# EAGLE design Adafruit MCP2221 (EAGLE 9.5.2)
COMPANY: ADAFRUIT INDUSTRIES; DRAWN: LADYADA; REV: A
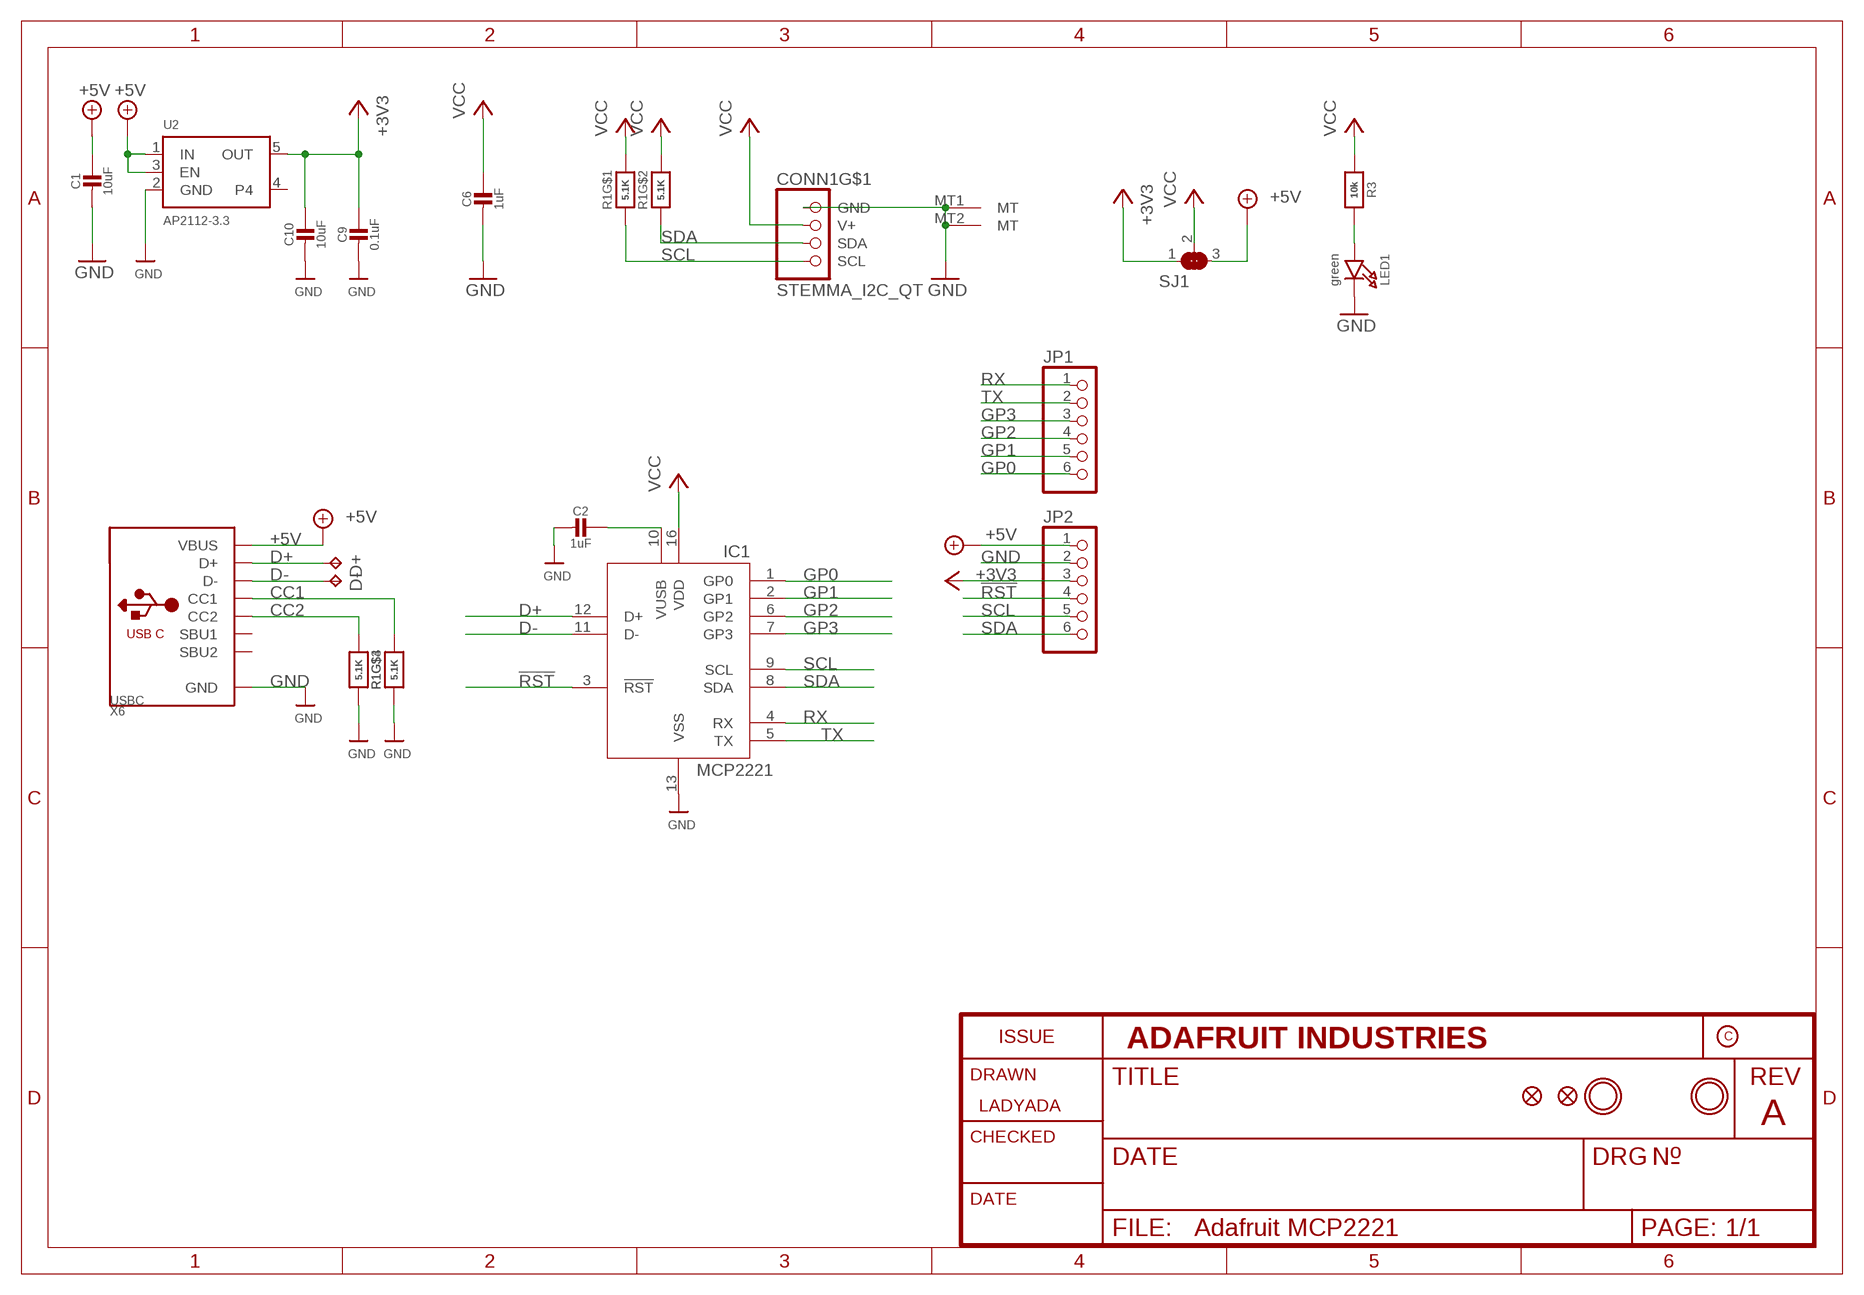
[diagram p0: schematic, sheet 1]

## Parts
C1  10uF  CAP_CERAMIC0805-NOOUTLINE  [0805-NO]
C2  1uF  CAP_CERAMIC0603_NO  [0603-NO]
C6  1uF  CAP_CERAMIC0603_NO  [0603-NO]
C9  0.1uF  CAP_CERAMIC0603_NO  [0603-NO]
C10  10uF  CAP_CERAMIC0805-NOOUTLINE  [0805-NO]
CONN1  STEMMA_I2C_QT  [JST_SH4]
D+  TPTP17R  [TP17R]
D-  TPTP17R  [TP17R]
FID1  FIDUCIAL_1MM  [FIDUCIAL_1MM]
FID2  FIDUCIAL_1MM  [FIDUCIAL_1MM]
IC1  MCP2221_ML  [QFN16_4MM]
JP1  HEADER-1X670MIL  [1X06_ROUND_70]
JP2  HEADER-1X670MIL  [1X06_ROUND_70]
LED1  green  LED0603_NOOUTLINE  [CHIPLED_0603_NOOUTLINE]
R1  5.1K  RESISTOR_4PACK  [RESPACK_4X0603]
R3  10k  RESISTOR_0603_NOOUT  [0603-NO]
SJ1  SOLDERJUMPER_2WAY  [SOLDERJUMPER_2WAY_OPEN_NOPASTE]
U2  AP2112-3.3  VREG_SOT23-5  [SOT23-5]
U$6  MOUNTINGHOLE2.5  [MOUNTINGHOLE_2.5_PLATED]
U$7  MOUNTINGHOLE2.5  [MOUNTINGHOLE_2.5_PLATED]
X6  USBC  USB_C  [USB_C_CUSB31-CFM2AX-01-X]

## Nets
!RST: IC1.3(!RST) JP2.4
+3V3: C9.1 C10.1 JP2.3 SJ1.1 U2.5(OUT)
+5V: C1.1 JP2.1 SJ1.3 U2.1(IN) U2.3(EN) X6.A4B9(VBUS) X6.B4A9(VBUS)
CC1: R1.6 X6.A5(CC1)
CC2: R1.4 X6.B5(CC2)
D+: D+.TP IC1.12(D+) X6.A6(D+) X6.B6(D+)
D-: D-.TP IC1.11(D-) X6.A7(D-) X6.B7(D-)
GND: C1.2 C2.2 C6.2 C9.2 C10.2 CONN1.1(GND) CONN1.MT1(MT) CONN1.MT2(MT) IC1.13(VSS) JP2.2 LED1.C R1.3 R1.5 U2.2(GND) X6.A1B12(GND) X6.B1A12(GND)
GP0: IC1.1(GP0) JP1.6
GP1: IC1.2(GP1) JP1.5
GP2: IC1.6(GP2) JP1.4
GP3: IC1.7(GP3) JP1.3
N$1: C2.1 IC1.10(VUSB)
N$8: LED1.A R3.2
RX: IC1.4(RX) JP1.1
SCL: CONN1.4(SCL) IC1.9(SCL) JP2.5 R1.1
SDA: CONN1.3(SDA) IC1.8(SDA) JP2.6 R1.2
TX: IC1.5(TX) JP1.2
VCC: C6.1 CONN1.2(V+) IC1.16(VDD) R1.7 R1.8 R3.1 SJ1.2
Unconnected: U2.4 X6.A8(SBU1) X6.B8(SBU2)

## Library data of the parts
C1 C2 C6 C9 = microbuilder:CAP_CERAMIC: Ceramic Capacitors For new designs, use the packages preceded by an '_' character since they are more reliable: The following footprints should be used on most boards: _0402 - Standard footprint for regular board layouts _0603 - Standard footprint for regular board layouts _0805 - Standard footprint for regular board layouts _1206 - Standard footprint for regular board layouts For extremely tight-pitch boards where space is at a premium, the following 'micro-pitch' footprints can be used (smaller pads, no silkscreen outline, etc.): _0402MP - Micro-pitch footprint for very dense/compact boards _0603MP - Micro-pitch footprint for very dense/compact boards _0805MP - Micro-pitch footprint for very dense/compact boards _1206MP - Micro-pitch footprint for very dense/compact boards
C10 = microbuilder:CAP_CERAMIC: Ceramic Capacitors For new designs, use the packages preceded by an '_' character since they are more reliable: The following footprints should be used on most boards: _0402 - Standard footprint for regular board layouts _0603 - Standard footprint for regular board layouts _0805 - Standard footprint for regular board layouts _1206 - Standard footprint for regular board layouts For extremely tight-pitch boards where space is at a premium, the following 'micro-pitch' footprints can be used (smaller pads, no silkscreen outline, etc.): _0402MP - Micro-pitch footprint for very dense/compact boards _0603MP - Micro-pitch footprint for very dense/compact boards _0805MP - Micro-pitch footprint for very dense/compact boards _1206MP - Micro-pitch footprint for very dense/compact boards; REV: A
CONN1 = microbuilder:STEMMA_I2C
D+ D- = testpad:TP: Test pad
FID1 FID2 = microbuilder:FIDUCIAL: Fiducial Alignment Points Various fiducial points for machine vision alignment.; BOM: EXCLUDE
IC1 = microbuilder:MCP2221
JP1 JP2 = microbuilder:HEADER-1X6: PIN HEADER
LED1 = microbuilder:LED: LED 0603 - 0603 Surface Mount Package 2mA: Green LED - Low Power (3.9mcd, 2ma, 1.7Vf) - Digikey: 475-2709-2-ND Orange LED - Low Power (9.8mcd, 2ma, 1.8Vf) - Digikey: 475-1194-2-ND Red LED - Low Power (5mcd, 2ma, 1.8Vf) - Digikey: 475-1195-2-ND Yellow LED - Low Power (7mcd, 2ma, 1.8Vf) - Digikey: 475-1196-2-ND 5mA: Blue LED - Low Power (17mcd, 5ma, 2.9Vf) - Digikey: LNJ937W8CRACT-ND 0805 - 0805 Surface Mount Package 2mA: Red LED (8.8mcd, 2mA, 1.8Vf, Clear) - Low Power [Digikey: 475-2510-1-ND] Green LED (5mcd, 2mA, 1.8Vf, Clear) - Low Power [Digikey: 475-2730-1-ND] Yellow LED (11.3mcd, 2mA, 1.8Vf, Clear) - Low Power [Digikey: 475-2555-1-ND] 20mA: Red LED (104mcd, 20mA, Diffused) - LS R976 [Digikey: 475-1278-6-ND] Red LED (12mcd, 20mA, 2.0Vf, Clear) - APT2012EC [Digikey: 754-1128-1-ND] Green LED (15mcd, 20mA, 2.2Vf, Clear) - APT2012GC [Digikey: 754-1131-1-ND] Orange LED (160mcd, 20mA, 2.1Vf, Clear) - APT2012SECK [Digikey: 754-1130-1-ND] 1206 - 1206 Surface Mount Package Green LED (26mcd, 20mA, Diffused) - LG N971 [Digikey: 475-1407-6-ND] Red LED (15mcd, 20mA, Diffused) - LH N974 [Digikey: 475-1416-6-ND] Cree - Cree High-Power Surface Mount LEDs XPEBWT-L1-0000-00D50 - White 111lm 350mA 2.9Vf 6200K 110° XTEAWT-00-0000-00000LEE3 - White 114lm 350mA 2.85Vf 5000K 115° Everlight - Everlight 45-21 Series Surface Mount LEDs 45-21/QK2C-B2832AC2CB2/2T - Warm White 2000mcd 20mA 3.25Vf 3050K 120° 45-21/LK2C-B38452C4CB2/2T - Nuetral White 2000mcd 20mA 3.25Vf 4150K 120° 45-21/LK2C-B50634C6CB2/2T - Cold White 2200mcd 20mA 3.25Vf 5650K 120° PLCC2 Reverse Mount LS T77K-J1L2-1-0-2-R18-Z - Red 11.25mcd 2mA 1.8Vf 630nm 120° LO T77K-L1M2-24-Z - Orange 19.6mcd 2mA 1.8Vf 606nm 120° LY T77K-K2M1-26-Z - Yellow 15.7mcd 2mA 1.8Vf 587nm 120°
R1 = microbuilder:RESISTOR_4PACK: Resistor Packs (4 resistors) 4 x 0603 10K 1/16W - Digikey: YC164J-10KCT-ND
R3 = microbuilder:RESISTOR: Resistors For new designs, use the packages preceded by an '_' character since they are more reliable: The following footprints should be used on most boards: _0402 - Standard footprint for regular board layouts _0603 - Standard footprint for regular board layouts _0805 - Standard footprint for regular board layouts _1206 - Standard footprint for regular board layouts For extremely tight-pitch boards where space is at a premium, the following 'micro-pitch' footprints can be used (smaller pads, no silkscreen outline, etc.): _0402MP - Micro-pitch footprint for very dense/compact boards _0603MP - Micro-pitch footprint for very dense/compact boards _0805MP - Micro-pitch footprint for very dense/compact boards _1206MP - Micro-pitch footprint for very dense/compact boards
SJ1 = microbuilder:SOLDERJUMPER_2WAY: 2-Way Solder Jumper
U2 = microbuilder:VREG_SOT23-5: SOT23-5 Fixed Voltage Regulators Part Current Out V Out V In V Dropout θJA (°C/W) TJ (°C) Digikey Part No. ADP121 150mA 3.3V 3.4-5.5V 0.09V @ 150mA -- -- ADP121-AUJZ33R7CT-ND ADP121 150mA 3.0V 3.1-5.5V 0.09V @ 150mA -- -- ADP121-AUJZ30R7CT-ND ADP122 300mA 3.3V 3.4-5.5V 0.085V @ 300mA -- -- ADP122AUJZ-3.3-R7CT-ND ADP1712 300mA 3.3V 3.5-5.5V 0.17V @ 300mA -- -- ADP1712AUJZ-3.3-R7TR-ND AP7311 (Low Cost) 150mA 3.3V 3.5-6V 0.15V @ 150mA -- -- AP7311-33WG-7DICT-ND LD39015M18R 150mA 1.8V 1.9V-5.5V 0.08V @ 100mA -- -- 497-6977-1-ND LP2985A-33DBVR 150mA 3.3V 3.3-16V 0.28V @ 150mA 206 150 296-18479-1-ND MCP1824T-3302E/OT 300mA 3.3V 3.5V-6V 0.2V @ 300mA -- -- MCP1824T-3302E/OTCT-ND MIC5205-2.5YM5 TR 150mA 2.5V 2.7-16V 0.165V @ 150mA -- -- 576-1257-2-ND MIC5205-3.0YM5 TR 150mA 3.0V 3.2V-16V 0.165V @ 150mA -- -- 576-1258-2-ND MIC5205-3.3YM5 TR 150mA 3.3V 3.5V-16V 0.165V @ 150mA -- -- 576-1259-2-ND TPS780330220 150mA 3.3V+2.2V 3.6-5.5V 250mV Max -- -- 296-23332-1-ND TDA3663/N1,135 100mA 3.3V 3.5-45V 0.18V @ 50mA -- -- 568-5343-1-ND Max operating temp can be calculated using θJA, TJ (max junction temperature), and power in watts. Set the "Maximum Ambient Temperature" until it reaches TJ ("Max Junction Temperature"), which is the absolute limit for safe use of the regulator: Heat Sink Temperature Calculator <http://www.daycounter.com/Calculators/Heat-Sink-Temperature-Calculator.phtml> For example, With 12V source into a 3.3V LP2985 and a 30mA load, we are dissipating (12V-3.3V) * 0.03A = 0.261W. With a θJA of 206 °C/W, a TJ of 150°C, and 261mW we can safely use the chip without a heat sink up to 75°C (=147.1°C Junction Temperature).
U$6 = microbuilder:MOUNTINGHOLE: Mounting Hole For #2 screws (0.086"/2.18mm width, 0.094"/2.4mm hole) use 2.5mm; BOM: EXCLUDE; REV: D
U$7 = microbuilder:MOUNTINGHOLE: Mounting Hole For #2 screws (0.086"/2.18mm width, 0.094"/2.4mm hole) use 2.5mm; BOM: EXCLUDE
X6 = microbuilder:USB_C: USB Type-C USB 2.0 Connector

## Net classes
1 power: width 0.305 mm
2 gnd: width 0.254 mm

## Board
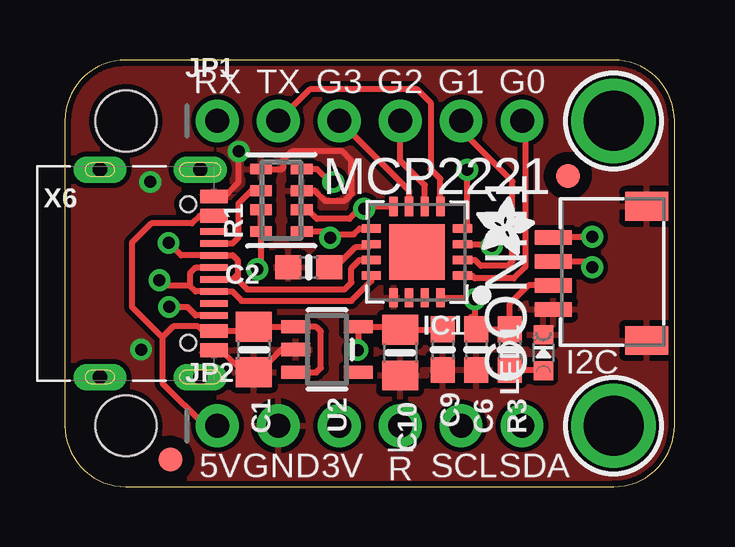
[diagram p1: board, top side]
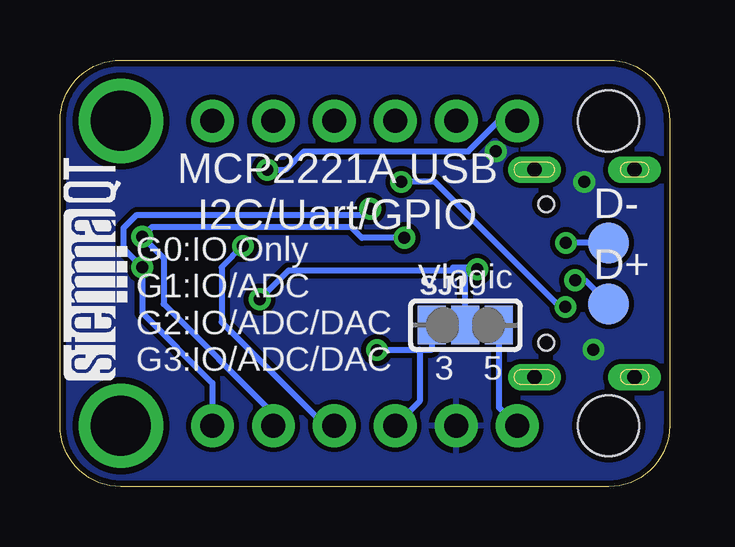
[diagram p2: board, bottom side, seen from below]

Size 25.4 x 17.78 mm. Coordinates in mm from the lower left corner, seen from the top.
Outline: 0,15.24 0,2.54 arc90 2.54,0 22.86,0 arc90 25.4,2.54 25.4,15.24 arc90 22.86,17.78 2.54,17.78 arc90 0,15.24
Copper layers (1*16): Top 0.035mm / dielectric 1.5mm / Bottom 0.035mm
Design rules "adafruit *": minimum track width 8mil, minimum drill 15.5mil, track to track 8mil, track to pad 8mil, pad to pad 8mil, via to via 8mil, smd to smd 8mil, copper to edge 10mil, drill to drill 8mil, minimum pad ring 10mil, minimum via ring 8mil, stop-mask expansion 2mil, vias tented up to drill 20mil, thermal gap 10mil
Holes 2.54 mm at 2.54,15.24 2.54,2.54

### Footprints (pad centres in the part's own frame; a part is rotated, then mirrored left to right if it is on the bottom)
0805-NO = smd 1.24 x 1.5: 1 -0.95,0; 2 0.95,0
0603-NO = smd 1.075 x 1: 1 -0.85,0; 2 0.85,0
JST_SH4 = smd 0.6 x 1.55: 1 -1.5,2.514; 2 -0.5,2.514; 3 0.5,2.514; 4 1.5,2.514 | smd 1.2 x 1.8: MT1 -2.8,-1.386; MT2 2.8,-1.386
TP17R = smd 1.7 x 1.7: TP 0,0
FIDUCIAL_1MM = smd 1 x 1: 1 0,0
QFN16_4MM = smd 0.8 x 0.35: 1 -1.9,0.975; 2 -1.9,0.325; 3 -1.9,-0.325; 4 -1.9,-0.975; 9 1.9,-0.975; 10 1.9,-0.325; 11 1.9,0.325; 12 1.9,0.975 | smd 0.35 x 0.8: 5 -0.975,-1.9; 6 -0.325,-1.9; 7 0.325,-1.9; 8 0.975,-1.9; 13 0.975,1.9; 14 0.325,1.9; 15 -0.325,1.9; 16 -0.975,1.9 | smd 2.3 x 2.3: THERMAL 0,0
1X06_ROUND_70 = drill 1 pad 1.778: 1 -6.35,0; 2 -3.81,0; 3 -1.27,0; 4 1.27,0; 5 3.81,0; 6 6.35,0
CHIPLED_0603_NOOUTLINE = smd 0.8 x 0.8: A 0,-0.75; C 0,0.75
RESPACK_4X0603 = smd 0.45 x 0.9: 1 -1.3,-0.85; 2 -0.4,-0.85; 3 0.4,-0.85; 4 1.3,-0.85; 5 1.3,0.85; 6 0.4,0.85; 7 -0.4,0.85; 8 -1.3,0.85
SOLDERJUMPER_2WAY_OPEN_NOPASTE = smd 1.168 x 1.6: 1 -1.397,0; 2 0,0; 3 1.397,0
SOT23-5 = smd 0.55 x 1.2: 1 -0.95,-1.3; 2 0,-1.3; 3 0.95,-1.3; 4 0.95,1.3; 5 -0.95,1.3
MOUNTINGHOLE_2.5_PLATED = drill 2.5 pad 3.2: P$1 0,0
USB_C_CUSB31-CFM2AX-01-X = smd 0.575 x 1.15: A1B12 -3.2,3.545; A4B9 -2.4,3.545; B1A12 3.2,3.545; B4A9 2.4,3.545 | smd 0.275 x 1.15: A5 -1.25,3.545; A6 -0.25,3.545; A7 0.25,3.545; A8 1.25,3.545; B5 1.75,3.545; B6 0.75,3.545; B7 -0.75,3.545; B8 -1.75,3.545 | drill 0.6 pad 1 long: M1 -4.32,2.97; M2 4.32,2.97; M3 -4.32,-1.21; M4 4.32,-1.21 | hole 0.65: 2.89,2.47; -2.89,2.47

### Placement (x,y rotation side)
C1  7.87,5.71 270 top
C2  10.16,9.14 180 top
C6  17.14,5.71 270 top
C9  15.75,5.71 270 top
C10  13.97,5.59 270 top
CONN1  22.86,8.89 90 top
D+  2.54,7.62 0 bottom
D-  2.54,10.16 0 bottom
FID1  4.39,1.13 0 top
FID2  20.95,12.95 0 top
IC1  14.67,9.78 180 top
JP1  12.7,15.24 0 top
JP2  12.7,2.54 0 top
LED1  19.94,5.59 0 top
R1  9.02,11.94 90 top
R3  18.54,5.71 270 top
SJ1  8.51,6.73 0 bottom
U2  10.92,5.71 270 top
U$2  [ADAFRUIT_2.5MM]  17.14,9.65 0 top
U$3  [STEMMAQT]  22.61,4.45 90 bottom
U$6  22.86,15.24 0 top
U$7  22.86,2.54 0 top
X6  2.67,8.89 270 top

### Tracks (layer width: path | path; a pad name or v marks a point on that pad's centre or on a via)
!RST  (via drill 0.5)
  Top 0.254: IC1.3 17.71,10.1 v17.78,10.03
  Bottom 0.254: v17.78,10.03 18.67,9.14 18.67,6.86 14.35,2.54 JP2.4
+3V3  (via drill 0.5)
  Top 0.254: C9.1 15.72,6.54 C10.1 13.84,6.67 U2.5 12.22,5.73 v12.19,5.7
  Bottom 0.254: SJ1.1 9.91,5.71 10.41,5.71 | 10.41,5.71 10.41,3.56 JP2.3 | v12.19,5.7 12.17,5.71 10.41,5.71
+5V
  Top 0.254: U2.3 10.48,4.76 10.67,4.95 10.67,6.48 10.48,6.67 U2.1 C1.1 7.7,6.49 X6.B4A9 5.74,6.49 5.55,6.68 4.52,6.68 4.06,6.22 | 4.06,6.22 4.06,4.32 5.84,2.54 JP2.1 | X6.A4B9 5.61,11.29 5.29,10.97 3.61,10.97 2.79,10.16 2.79,7.49 4.06,6.22
  Bottom 0.254: SJ1.3 7.11,3.3 JP2.1
CC1
  Top 0.254: X6.A5 6.98,10.14 7.24,10.4 7.24,11.81 7.77,12.34 R1.6
CC2  (via drill 0.5)
  Top 0.254: X6.B5 5.44,7.14 5.09,7.49 v4.34,7.49 | v11.18,12.7 11.05,12.7 10.51,13.24 R1.4
  Bottom 0.254: v4.34,7.49 4.57,7.49 9.78,12.7 v11.18,12.7
D+  (via drill 0.5)
  Top 0.254: IC1.12 12.77,8.58 11.94,7.75 7.37,7.75 6.97,8.14 X6.B6 5.45,8.14 5.21,8.38 | 5.21,8.38 5.21,8.89 5.46,9.14 X6.A6 | 5.21,8.38 4.16,8.38 v3.94,8.6
  Bottom 0.254: v3.94,8.6 3.52,8.6 D+.TP
D-  (via drill 0.5)
  Top 0.254: IC1.11 12.29,9.45 11.94,9.11 11.94,8.51 11.65,8.22 7.59,8.22 7.22,8.6 7.22,8.88 | 7.22,8.88 7.22,9.42 6.99,9.65 6.22,9.65 X6.B7 4.84,9.64 v4.32,10.16 | X6.A7 6.98,8.64 7.22,8.88
  Bottom 0.254: D-.TP v4.32,10.16
GND  (via drill 0.5)
  Top 0.254: X6.A1B12 6.63,12.09 7.24,12.7 v7.24,13.97 | U2.2 9.02,5.71 8.07,4.76 C1.2 7.43,4.76 6.5,5.69 X6.B1A12 | R1.3 10.39,12.34 10.82,11.92 11.66,11.92 11.96,12.21 11.96,13.02 11.94,13.05 11.94,13.59 11.56,13.97 9.46,13.97 9.09,13.6 9.09,13.28 9.02,13.21 8.2,13.21 R1.5
  other vias: 3.56,12.7 3.17,5.71
  pour Top: 0,17.78 25.4,17.78 25.4,0 0,0
  pour Bottom: 0,17.78 25.4,17.78 25.4,0 0,0
GP0
  Top 0.254: IC1.1 16.95,8.8 17.08,8.68 18.71,8.68 19.18,9.14 19.18,15.11 JP1.6
GP1
  Top 0.254: IC1.2 17.08,9.45 17.33,9.2 18.45,9.2 18.64,9.4 18.64,12.72 16.51,14.86 JP1.5
GP2
  Top 0.254: IC1.6 14.99,12.57 13.97,13.59 JP1.4
GP3
  Top 0.254: IC1.7 14.34,12.33 JP1.3
N$1
  Top 0.254: IC1.10 12.64,9.98 12.1,9.98 11.26,9.14 C2.1
N$2
  Bottom 0.254: 9.02,6.73 9.4,6.73
N$8
  Top 0.254: R3.2 19.91,4.87 LED1.A
RX  (via drill 0.5)
  Top 0.254: IC1.4 16.76,10.95 v16.76,13.21
  Bottom 0.254: v16.76,13.21 16,13.21 15.24,13.97 8.38,13.97 7.11,15.24 JP1.1
SCL  (via drill 0.5)
  Top 0.254: R1.1 11.05,10.64 11.05,10.51 | 11.05,10.51 12.04,10.51 12.28,10.75 IC1.9 | v21.97,10.41 21.95,10.39 CONN1.4 | 11.05,10.51 v11.05,10.37
  Bottom 0.254: JP2.5 16.51,3.05 21.08,7.62 21.08,9.53 v21.97,10.41 21.57,10.82 13.27,10.82 12.83,10.37 v11.05,10.37
SDA  (via drill 0.5)
  Top 0.254: R1.2 10.12,11.54 10.5,11.16 11.85,11.16 12.37,11.68 | 12.37,11.68 IC1.8 | CONN1.3 21.73,9.39 v21.97,9.14 | 12.37,11.68 12.48,11.78 v12.48,11.59
  Bottom 0.254: JP2.6 19.05,4.32 21.97,7.24 v21.97,9.14 22.75,9.93 22.75,10.77 22.2,11.33 12.73,11.33 v12.48,11.59
TX
  Top 0.254: IC1.5 15.64,12.82 15.24,13.23 15.24,16 14.68,16.56 10.21,16.56 JP1.2
VCC  (via drill 0.5)
  Top 0.254: R1.7 R1.8 8.17,9.21 v8.02,9.06 | 17.08,7.07 16.93,7.07 17.18,6.82 17.14,6.82 C6.1 | 17.08,7.07 v17.08,7.81 17.01,7.88 IC1.16 | 17.08,7.07 17.08,6.57 R3.1 18.54,7.62 19.31,8.39 CONN1.2
  Bottom 0.254: v8.02,9.06 8.1,9.14 9.02,9.14 9.02,9.02 | v17.08,7.81 15.88,9.02 9.02,9.02 | 9.02,9.02 8.51,9.02 SJ1.2

### Text on the board
tPlace: RX | TX | G3 | G2 | G1 | G0 | MCP2221 | I2C | 5V | GND | 3V | !R | SCL | SDA
bPlace: MCP2221A USB / I2C/Uart/GPIO | Vlogic | G0:IO Only / G1:IO/ADC / G2:IO/ADC/DAC / G3:IO/ADC/DAC | 5 | 3